# Altium project MSP432P401R核心板.PrjPcb
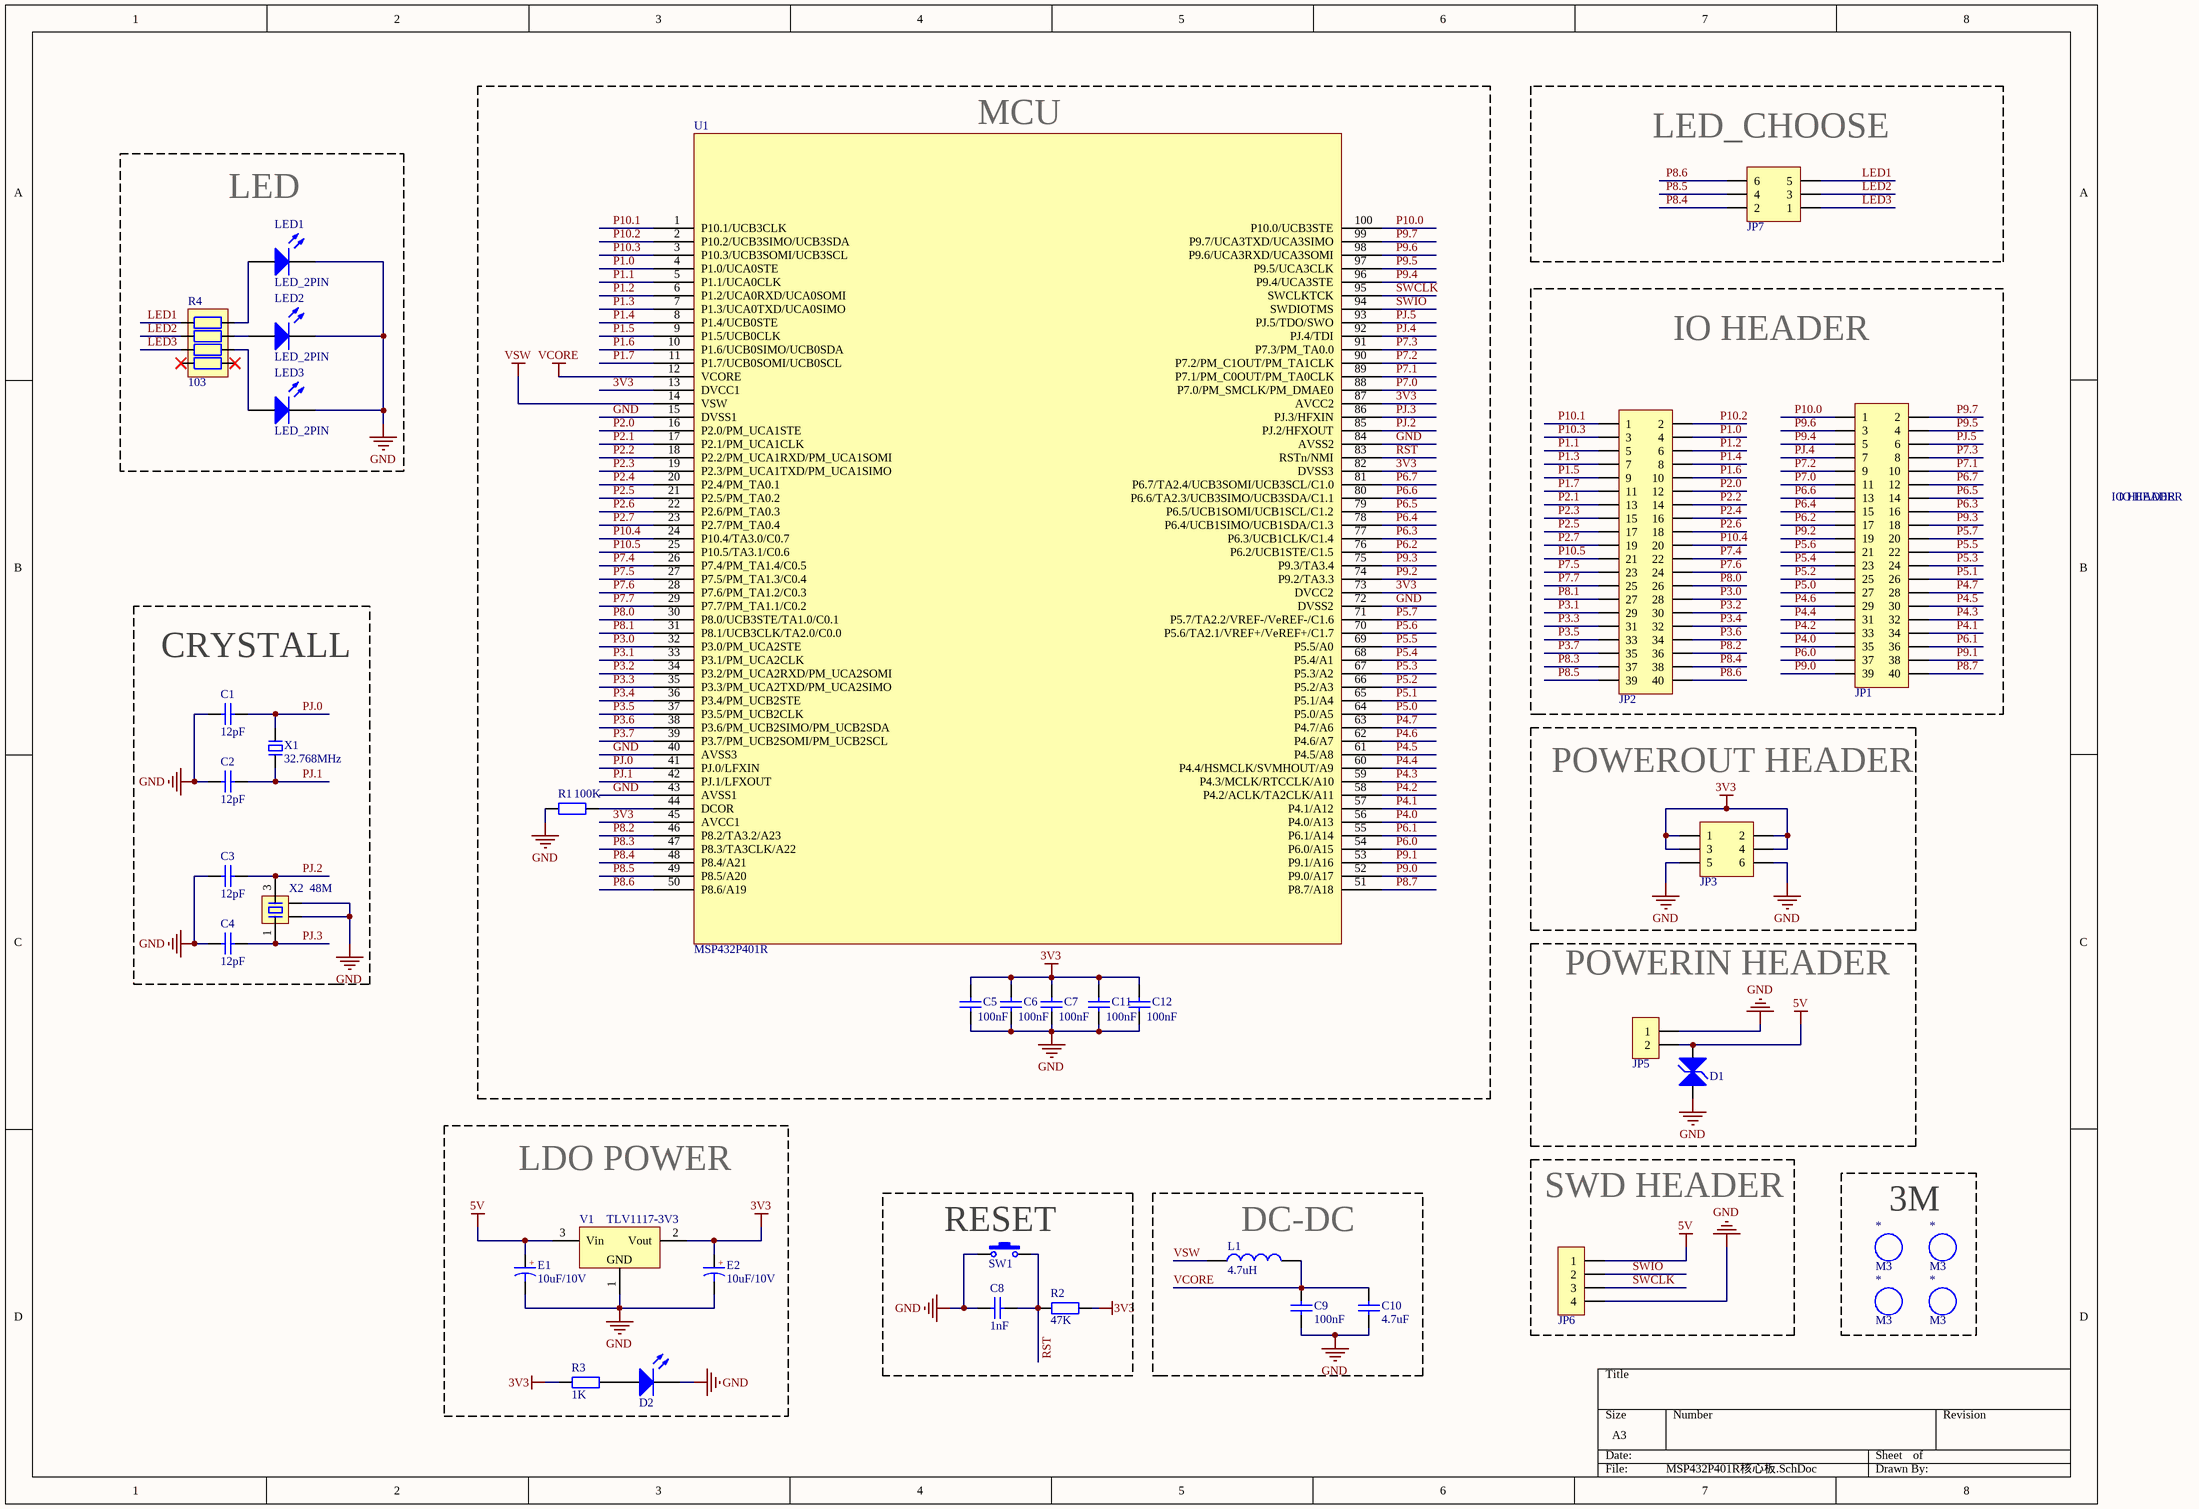
[diagram p0: MSP432P401R核心板.SchDoc]
1 sheet, 39 parts. Net scope: global (net labels, ports and power ports of the same name join across sheets).
Board file: MSP432P401R核心板.PcbDoc

## Sheet MSP432P401R核心板.SchDoc
size A3; SheetNumber: 1; SheetTotal: 1

### Parts
(Parts that share a designator on the sheet are numbered #1, #2 ... from top to bottom, then left to right.)
*#1  M3  [M3 125X300]
*#2  M3  [M3 125X300]
*#3  M3  [M3 125X300]
*#4  M3  [M3 125X300]
C1  12pF  [C0603_L]
C2  12pF  [C0603_L]
C3  12pF  [C0603_L]
C4  12pF  [C0603_L]
C5  100nF  [C0603_L]
C6  100nF  [C0603_L]
C7  100nF  [C0603_L]
C8  1nF  [C0603_L]
C9  100nF  [C0603_L]
C10  4.7uF  [C0603_L]
C11  100nF  [C0603_L]
C12  100nF  [C0603_L]
D1  TVS  [SMA]  (value not drawn)
D2  LED  [LED0603_B]  (value not drawn)
E1  10uF/10V  [CS 6*6 - B]
E2  10uF/10V  [CS 6*6 - B]
JP1  Header 2X11  [HDR2.54-LI-2x20P]  (value not drawn)
JP2  Header 2X11  [HDR2.54-LI-2x20P]  (value not drawn)
JP3  Header3X2  [HDR2.54-LI-2x3P]  (value not drawn)
JP5  HDR-1X2  [PH2.0-WS-2P]  (value not drawn)
JP6  HDR-1X4  [PH2.0-WS-4P]  (value not drawn)
JP7  Header3X2  [HDR2.54-LI-2x3P]  (value not drawn)
L1  4.7uH  [L0603]
LED1  LED_2PIN  [LED0603_B]
LED2  LED_2PIN  [LED0603_G]
LED3  LED_2PIN  [LED0603_Y]
R1  100K  [R0603_L]
R2  47K  [R0603_L]
R3  1K  [R0603_L]
R4  103  [RCA-8P4R-0603]
SW1  3x6x5  [SW SMD-3*6*2.5]  (value not drawn)
U1  MSP432P401R  [QFP100]
V1  TLV1117-3V3  [SOT223_L]
X1  32.768MHz  [OSC 3215-2P]
X2  48M  [OSC 3225-4P]

### Blocks framed on the sheet
MCU: C5-C7 C11 C12 R1 U1
LED_CHOOSE: JP7
LED: LED1-LED3 R4
IO HEADER: JP1 JP2
CRYSTALL: C1-C4 X1 X2
POWEROUT HEADER: JP3
POWERIN HEADER: D1 JP5
LDO POWER: D2 E1 E2 R3 V1
RESET: C8 R2 SW1
DC-DC: C9 C10 L1
SWD HEADER: JP6
3M: *#1-*#4

### Nets
3V3: C5.2 C6.2 C7.2 C11.2 C12.2 E2.1 JP3.1 JP3.2 JP3.3 JP3.4 R2.2 R3.1 U1.13(DVCC1) U1.45(AVCC1) U1.73(DVCC2) U1.82(DVSS3) U1.87(AVCC2) V1.2(Vout)
5V: D1.2(K) E1.1 JP5.2 JP6.1 V1.3(Vin)
GND: C1.1 C2.1 C3.1 C4.1 C5.1 C6.1 C7.1 C8.1 C9.1 C10.1 C11.1 C12.1 D1.1(A) D2.2(K) E1.2 E2.2 JP3.5 JP3.6 JP5.1 JP6.4 LED1.2(K) LED2.2(K) LED3.2(K) R1.1 SW1.1 U1.15(DVSS1) U1.40(AVSS3) U1.43(AVSS1) U1.72(DVSS2) U1.84(AVSS2) V1.1(GND) X2.2 X2.4
VCORE: C9.2 C10.2 L1.2 U1.12(VCORE)
VSW: L1.1 U1.14(VSW)
LED1: JP7.5 R4.1
LED2: JP7.3 R4.2
LED3: JP7.1 R4.3
P1.0: JP2.4 U1.4(P1.0/UCA0STE)
P1.1: JP2.5 U1.5(P1.1/UCA0CLK)
P1.2: JP2.6 U1.6(P1.2/UCA0RXD/UCA0SOMI)
P1.3: JP2.7 U1.7(P1.3/UCA0TXD/UCA0SIMO)
P1.4: JP2.8 U1.8(P1.4/UCB0STE)
P1.5: JP2.9 U1.9(P1.5/UCB0CLK)
P1.6: JP2.10 U1.10(P1.6/UCB0SIMO/UCB0SDA)
P1.7: JP2.11 U1.11(P1.7/UCB0SOMI/UCB0SCL)
P2.0: JP2.12 U1.16(P2.0/PM_UCA1STE)
P2.1: JP2.13 U1.17(P2.1/PM_UCA1CLK)
P2.2: JP2.14 U1.18(P2.2/PM_UCA1RXD/PM_UCA1SOMI)
P2.3: JP2.15 U1.19(P2.3/PM_UCA1TXD/PM_UCA1SIMO)
P2.4: JP2.16 U1.20(P2.4/PM_TA0.1)
P2.5: JP2.17 U1.21(P2.5/PM_TA0.2)
P2.6: JP2.18 U1.22(P2.6/PM_TA0.3)
P2.7: JP2.19 U1.23(P2.7/PM_TA0.4)
P3.0: JP2.28 U1.32(P3.0/PM_UCA2STE)
P3.1: JP2.29 U1.33(P3.1/PM_UCA2CLK)
P3.2: JP2.30 U1.34(P3.2/PM_UCA2RXD/PM_UCA2SOMI)
P3.3: JP2.31 U1.35(P3.3/PM_UCA2TXD/PM_UCA2SIMO)
P3.4: JP2.32 U1.36(P3.4/PM_UCB2STE)
P3.5: JP2.33 U1.37(P3.5/PM_UCB2CLK)
P3.6: JP2.34 U1.38(P3.6/PM_UCB2SIMO/PM_UCB2SDA)
P3.7: JP2.35 U1.39(P3.7/PM_UCB2SOMI/PM_UCB2SCL)
P4.0: JP1.35 U1.56(P4.0/A13)
P4.1: JP1.34 U1.57(P4.1/A12)
P4.2: JP1.33 U1.58(P4.2/ACLK/TA2CLK/A11)
P4.3: JP1.32 U1.59(P4.3/MCLK/RTCCLK/A10)
P4.4: JP1.31 U1.60(P4.4/HSMCLK/SVMHOUT/A9)
P4.5: JP1.30 U1.61(P4.5/A8)
P4.6: JP1.29 U1.62(P4.6/A7)
P4.7: JP1.28 U1.63(P4.7/A6)
P5.0: JP1.27 U1.64(P5.0/A5)
P5.1: JP1.26 U1.65(P5.1/A4)
P5.2: JP1.25 U1.66(P5.2/A3)
P5.3: JP1.24 U1.67(P5.3/A2)
P5.4: JP1.23 U1.68(P5.4/A1)
P5.5: JP1.22 U1.69(P5.5/A0)
P5.6: JP1.21 U1.70(P5.6/TA2.1/VREF+/VeREF+/C1.7)
P5.7: JP1.20 U1.71(P5.7/TA2.2/VREF-/VeREF-/C1.6)
P6.0: JP1.37 U1.54(P6.0/A15)
P6.1: JP1.36 U1.55(P6.1/A14)
P6.2: JP1.17 U1.76(P6.2/UCB1STE/C1.5)
P6.3: JP1.16 U1.77(P6.3/UCB1CLK/C1.4)
P6.4: JP1.15 U1.78(P6.4/UCB1SIMO/UCB1SDA/C1.3)
P6.5: JP1.14 U1.79(P6.5/UCB1SOMI/UCB1SCL/C1.2)
P6.6: JP1.13 U1.80(P6.6/TA2.3/UCB3SIMO/UCB3SDA/C1.1)
P6.7: JP1.12 U1.81(P6.7/TA2.4/UCB3SOMI/UCB3SCL/C1.0)
P7.0: JP1.11 U1.88(P7.0/PM_SMCLK/PM_DMAE0)
P7.1: JP1.10 U1.89(P7.1/PM_C0OUT/PM_TA0CLK)
P7.2: JP1.9 U1.90(P7.2/PM_C1OUT/PM_TA1CLK)
P7.3: JP1.8 U1.91(P7.3/PM_TA0.0)
P7.4: JP2.22 U1.26(P7.4/PM_TA1.4/C0.5)
P7.5: JP2.23 U1.27(P7.5/PM_TA1.3/C0.4)
P7.6: JP2.24 U1.28(P7.6/PM_TA1.2/C0.3)
P7.7: JP2.25 U1.29(P7.7/PM_TA1.1/C0.2)
P8.0: JP2.26 U1.30(P8.0/UCB3STE/TA1.0/C0.1)
P8.1: JP2.27 U1.31(P8.1/UCB3CLK/TA2.0/C0.0)
P8.2: JP2.36 U1.46(P8.2/TA3.2/A23)
P8.3: JP2.37 U1.47(P8.3/TA3CLK/A22)
P8.4: JP2.38 JP7.2 U1.48(P8.4/A21)
P8.5: JP2.39 JP7.4 U1.49(P8.5/A20)
P8.6: JP2.40 JP7.6 U1.50(P8.6/A19)
P8.7: JP1.40 U1.51(P8.7/A18)
P9.0: JP1.39 U1.52(P9.0/A17)
P9.1: JP1.38 U1.53(P9.1/A16)
P9.2: JP1.19 U1.74(P9.2/TA3.3)
P9.3: JP1.18 U1.75(P9.3/TA3.4)
P9.4: JP1.5 U1.96(P9.4/UCA3STE)
P9.5: JP1.4 U1.97(P9.5/UCA3CLK)
P9.6: JP1.3 U1.98(P9.6/UCA3RXD/UCA3SOMI)
P9.7: JP1.2 U1.99(P9.7/UCA3TXD/UCA3SIMO)
P10.0: JP1.1 U1.100(P10.0/UCB3STE)
P10.1: JP2.1 U1.1(P10.1/UCB3CLK)
P10.2: JP2.2 U1.2(P10.2/UCB3SIMO/UCB3SDA)
P10.3: JP2.3 U1.3(P10.3/UCB3SOMI/UCB3SCL)
P10.4: JP2.20 U1.24(P10.4/TA3.0/C0.7)
P10.5: JP2.21 U1.25(P10.5/TA3.1/C0.6)
PJ.0: C1.2 U1.41(PJ.0/LFXIN) X1.2
PJ.1: C2.2 U1.42(PJ.1/LFXOUT) X1.1
PJ.2: C3.2 U1.85(PJ.2/HFXOUT) X2.3
PJ.3: C4.2 U1.86(PJ.3/HFXIN) X2.1
PJ.4: JP1.7 U1.92(PJ.4/TDI)
PJ.5: JP1.6 U1.93(PJ.5/TDO/SWO)
RST: C8.2 R2.1 SW1.2 U1.83(RSTn/NMI)
SWCLK: JP6.3 U1.95(SWCLKTCK)
SWIO: JP6.2 U1.94(SWDIOTMS)
NetD2_1: D2.1(A) R3.2
NetLED1_1: LED1.1(A) R4.8
NetLED2_1: LED2.1(A) R4.7
NetLED3_1: LED3.1(A) R4.6
NetR1_2: R1.2 U1.44(DCOR)

Not connected (* = marked no-connect by the designer): R4 4* 5*

### Notes on the sheet
- IO HEADER
- (in symbol CS_SMD) +

### Library data of the parts
*#1-*#4 = M3: 铜柱孔; 版权归属: 源创客; BOM名称: 铜柱孔; 学习资源: www.ooocke.com
C1-C12 = C: 贴片电容; BOM名称: 无极性贴片电容; 联系卖家，免费查找封装: 唯一出售店铺网址https://shop463601444.taobao.com; 封装库来自淘宝卖家ID：黄晶宝石: 其他店铺购入均为盗版假冒封装库
D1 = TVS: TVS保护; 联系卖家，免费查找封装: 唯一出售店铺网址https://shop463601444.taobao.com; Code_JEDEC: DO-214-AB
D2 = LED: 发光二极管; 封装库来自淘宝卖家 ID：黄晶宝石: 其他店铺购入均为假冒，请立即申请退款，本店奖励2~5元现金
E1 E2 = CS_SMD: 贴片固态电容; 联系卖家，免费查找封装: 唯一出售店铺网址https://shop463601444.taobao.com; 封装库来自淘宝卖家ID：黄晶宝石: 其他店铺购入均为盗版假冒封装库; BOM名称: 贴片固态电容
JP1 JP2 = Header 20X2: 20*2P接插件; 封装库来自淘宝卖家 ID：黄晶宝石: 其他店铺购入均为盗版假冒封装库; 联系卖家，免费查找封装: 唯一出售店铺网址https://shop463601444.taobao.com; BOM名称: 20*2P接插件
JP3 JP7 = Header 3X2: 3*2P接插件; 封装库来自淘宝卖家 ID：黄晶宝石: 其他店铺购入均为盗版假冒封装库; 联系卖家，免费查找封装: 唯一出售店铺网址https://shop463601444.taobao.com; BOM名称: 3*2P接插件
JP5 = Header 2: 2P接插件; 封装库来自淘宝卖家 ID：黄晶宝石: 其他店铺购入均为盗版假冒封装库; BOM名称: 2P接插件
JP6 = Header 4: 4P接插件; 封装库来自淘宝卖家 ID：黄晶宝石: 其他店铺购入均为盗版，不享受售后技术支持服务，请立即申请退款
L1 = L: 贴片小功率电感; BOM名称: 小功率贴片电感; 联系卖家，免费查找封装: 唯一出售店铺网址https://shop463601444.taobao.com; 封装库来自淘宝卖家ID：黄晶宝石: 其他店铺购入均为盗版假冒封装库
LED1-LED3 = LED_2PIN: 2脚LED; BOM名称: 插件LED; 封装库来自淘宝卖家 ID：黄晶宝石: 其他店铺购入均为假冒，请立即申请退款，本店奖励2~5元现金
R1-R3 = R: 贴片电阻; 联系卖家，免费查找封装: 唯一出售店铺网址https://shop463601444.taobao.com; 封装库来自淘宝卖家ID：黄晶宝石: 其他店铺购入均为盗版假冒封装库; BOM名称: 贴片电阻
R4 = R-8P4R: 贴片排阻; BOM名称: 贴片网络排阻; 联系卖家，免费查找封装: 唯一出售店铺网址https://shop463601444.taobao.com; 封装库来自淘宝卖家ID：黄晶宝石: 其他店铺购入均为盗版假冒封装库
SW1 = TSW_2PIN: 3x6轻触开关; 联系卖家，免费查找封装: 唯一出售店铺网址https://shop463601444.taobao.com; BOM名称: 3x6轻触开关
V1 = AMS1117: 三端稳压芯片; BOM名称: 稳压芯片; 封装库来自淘宝卖家 ID：黄晶宝石: 其他店铺购入均为假冒，请立即申请退款，本店奖励2~5元现金
X1 = XTAL-2P: 2脚无源脚晶振; 联系卖家，免费查找封装: 唯一出售店铺网址https://shop463601444.taobao.com; BOM名称: 2脚无源脚晶振
X2 = XTAL-4P: 4脚晶振; BOM名称: 4脚无源晶振; 联系卖家，免费查找封装: 唯一出售店铺网址https://shop463601444.taobao.com